# Altium project The Operator.PrjPcb
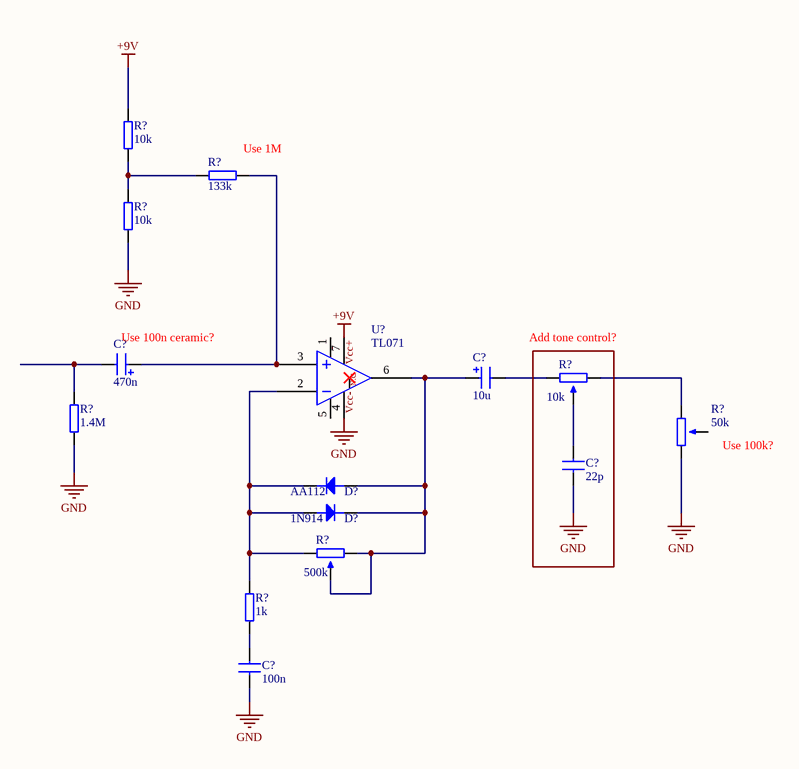
[diagram p0: The Operator.SchDoc]
1 sheet, 15 parts. Net scope: global (net labels, ports and power ports of the same name join across sheets).
Board file: The Operator.PcbDoc

## Sheet The Operator.SchDoc
size A4; SheetNumber: 1; SheetTotal: 1

### Parts
(Parts that share a designator on the sheet are numbered #1, #2 ... from top to bottom, then left to right.)
C?#1  470n  [C_Radial_D6.3mm_H6mm_P2.5mm]
C?#2  10u  [C_Radial_D6.3mm_H6mm_P2.5mm]
C?#3  22p  [C_CERAMIC_TH_P5.08mm]
C?#4  100n  [C_CERAMIC_TH_P5.08mm]
D?#1  AA112  [D_DO7_Axial_10.16mm]
D?#2  1N914  [D_DO35_Axial_7.62mm]
R?#1  10k  [R_Axial_7.62mm]
R?#2  133k  [R_Axial_7.62mm]
R?#3  10k  [R_Axial_7.62mm]
R?#4  10k  [Trimpot_TH_P5.08mm]
R?#5  1.4M  [R_Axial_7.62mm]
R?#6  50k  [Trimpot_TH_P5.08mm]
R?#7  500k  [Trimpot_TH_P5.08mm]
R?#8  1k  [R_Axial_7.62mm]
U?  TL071  [DIP8_W7.62mm_P2.54mm]

### Blocks framed on the sheet
Add tone control?: C?#3 R?#4

### Nets
+9V: R?#1.2 U?.7(Vcc+)
GND: C?#3.1 C?#4.1 R?#3.1 R?#5.1 R?#6.1 U?.4
NetC?#1_1: C?#1.1 R?#2.1 U?.3(Vin+)
NetC?#1_2: C?#1.2 R?#5.2
NetC?#2_1: C?#2.1 D?#1.1(An) D?#2.2(Cat) R?#7.2 R?#7.3 U?.6
NetC?#2_2: C?#2.2 R?#4.1
NetC?#3_2: C?#3.2 R?#4.2
NetC?#4_2: C?#4.2 R?#8.2
NetD?#1_2: D?#1.2(Cat) D?#2.1(An) R?#7.1 R?#8.1 U?.2(Vin-)
NetR?#1_1: R?#1.1 R?#2.2 R?#3.2
NetR?#4_3: R?#4.3 R?#6.3

Not connected (* = marked no-connect by the designer): R?#6 2; U? 1(Off_1) 5 8*

### Notes on the sheet
- (near R?#2) Use 1M
- (near C?#1) Use 100n ceramic?
- (near R?#6) Use 100k?
- (in symbol TL071) N.C; Vcc-

### Library data of the parts
C?#1 C?#2 = Cap TH Polarized: D6.3mm H6mm P2.5mm
C?#3 C?#4 = Cap Ceramic
D?#1 = Diode signal Ge: Small signal germanium diode. Electrokit art nr: 41015282; ComponentLink1Description: Electrokit; ComponentLink1URL: https://www.electrokit.com/produkt/aa112-do-7-15v-30ma-germanium/
D?#2 = Diode signal Si: Small signal silicon diode. Electrokit art nr: 40310914; ComponentLink1Description: Electrokit; ComponentLink1URL: https://www.electrokit.com/produkt/1n914-do-35-100v-200ma/
R?#1-R?#3 R?#5 R?#8 = Resistor TH: Axial P7.62mm
R?#4 R?#6 R?#7 = Pot TH: Trimpot TH 3386P
U? = TL071: ST TL071CN JFET OP Amp